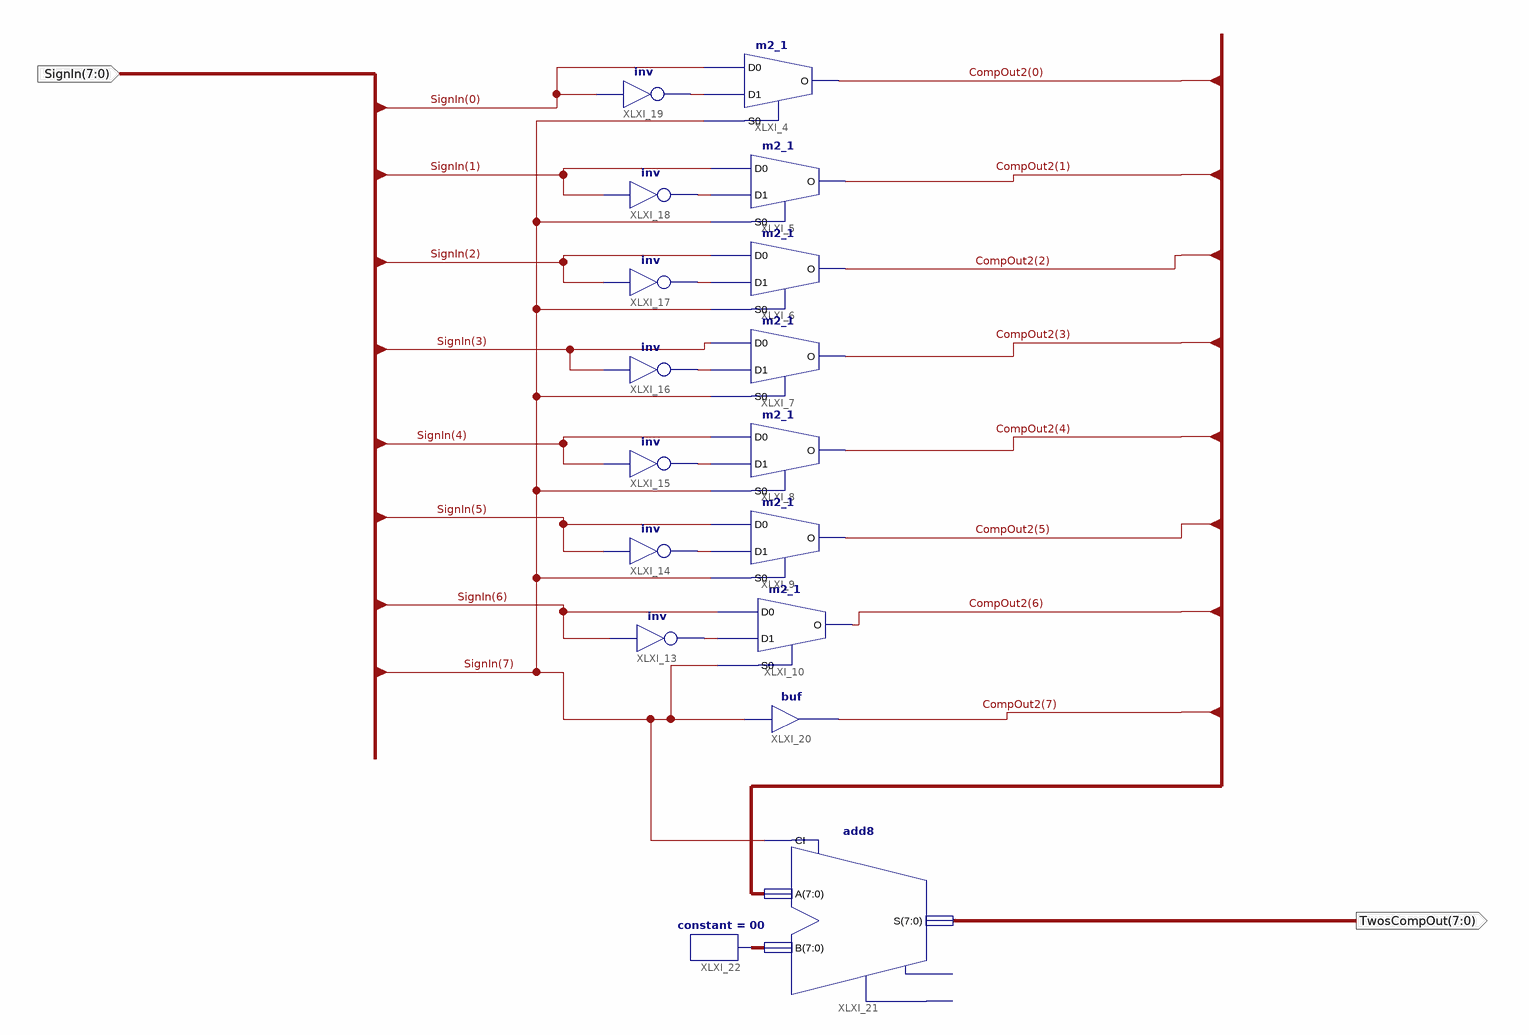
[diagram p0: schematic sheet 1]
// Xilinx ISE schematic SignedToTwosComp.sch (spartan3e) as structural Verilog: 17 symbols, 2 ports
module SignedToTwosComp (
  input  [7:0] SignIn,
  output [7:0] TwosCompOut
);

  wire XLXN_17, XLXN_18, XLXN_19, XLXN_20, XLXN_21, XLXN_22, XLXN_23;
  wire [7:0] CompOut2, XLXN_47;

  m2_1 XLXI_4 (.D0(SignIn[0]), .D1(XLXN_23), .S0(SignIn[7]), .O(CompOut2[0]));
  m2_1 XLXI_5 (.D0(SignIn[1]), .D1(XLXN_22), .S0(SignIn[7]), .O(CompOut2[1]));
  m2_1 XLXI_6 (.D0(SignIn[2]), .D1(XLXN_21), .S0(SignIn[7]), .O(CompOut2[2]));
  m2_1 XLXI_7 (.D0(SignIn[3]), .D1(XLXN_20), .S0(SignIn[7]), .O(CompOut2[3]));
  m2_1 XLXI_8 (.D0(SignIn[4]), .D1(XLXN_19), .S0(SignIn[7]), .O(CompOut2[4]));
  m2_1 XLXI_9 (.D0(SignIn[5]), .D1(XLXN_18), .S0(SignIn[7]), .O(CompOut2[5]));
  m2_1 XLXI_10 (.D0(SignIn[6]), .D1(XLXN_17), .S0(SignIn[7]), .O(CompOut2[6]));
  not XLXI_13 (XLXN_17, SignIn[6]);
  not XLXI_14 (XLXN_18, SignIn[5]);
  not XLXI_15 (XLXN_19, SignIn[4]);
  not XLXI_16 (XLXN_20, SignIn[3]);
  not XLXI_17 (XLXN_21, SignIn[2]);
  not XLXI_18 (XLXN_22, SignIn[1]);
  not XLXI_19 (XLXN_23, SignIn[0]);
  buf XLXI_20 (CompOut2[7], SignIn[7]);
  add8 XLXI_21 (.A(CompOut2), .B(XLXN_47), .CI(SignIn[7]), .S(TwosCompOut));  // open: CO, OFL
  constant #(.CValue("00")) XLXI_22 (.O(XLXN_47));
endmodule
